# EAGLE design pa_only_900 (EAGLE 6.2)

## Sheet 1 of 4
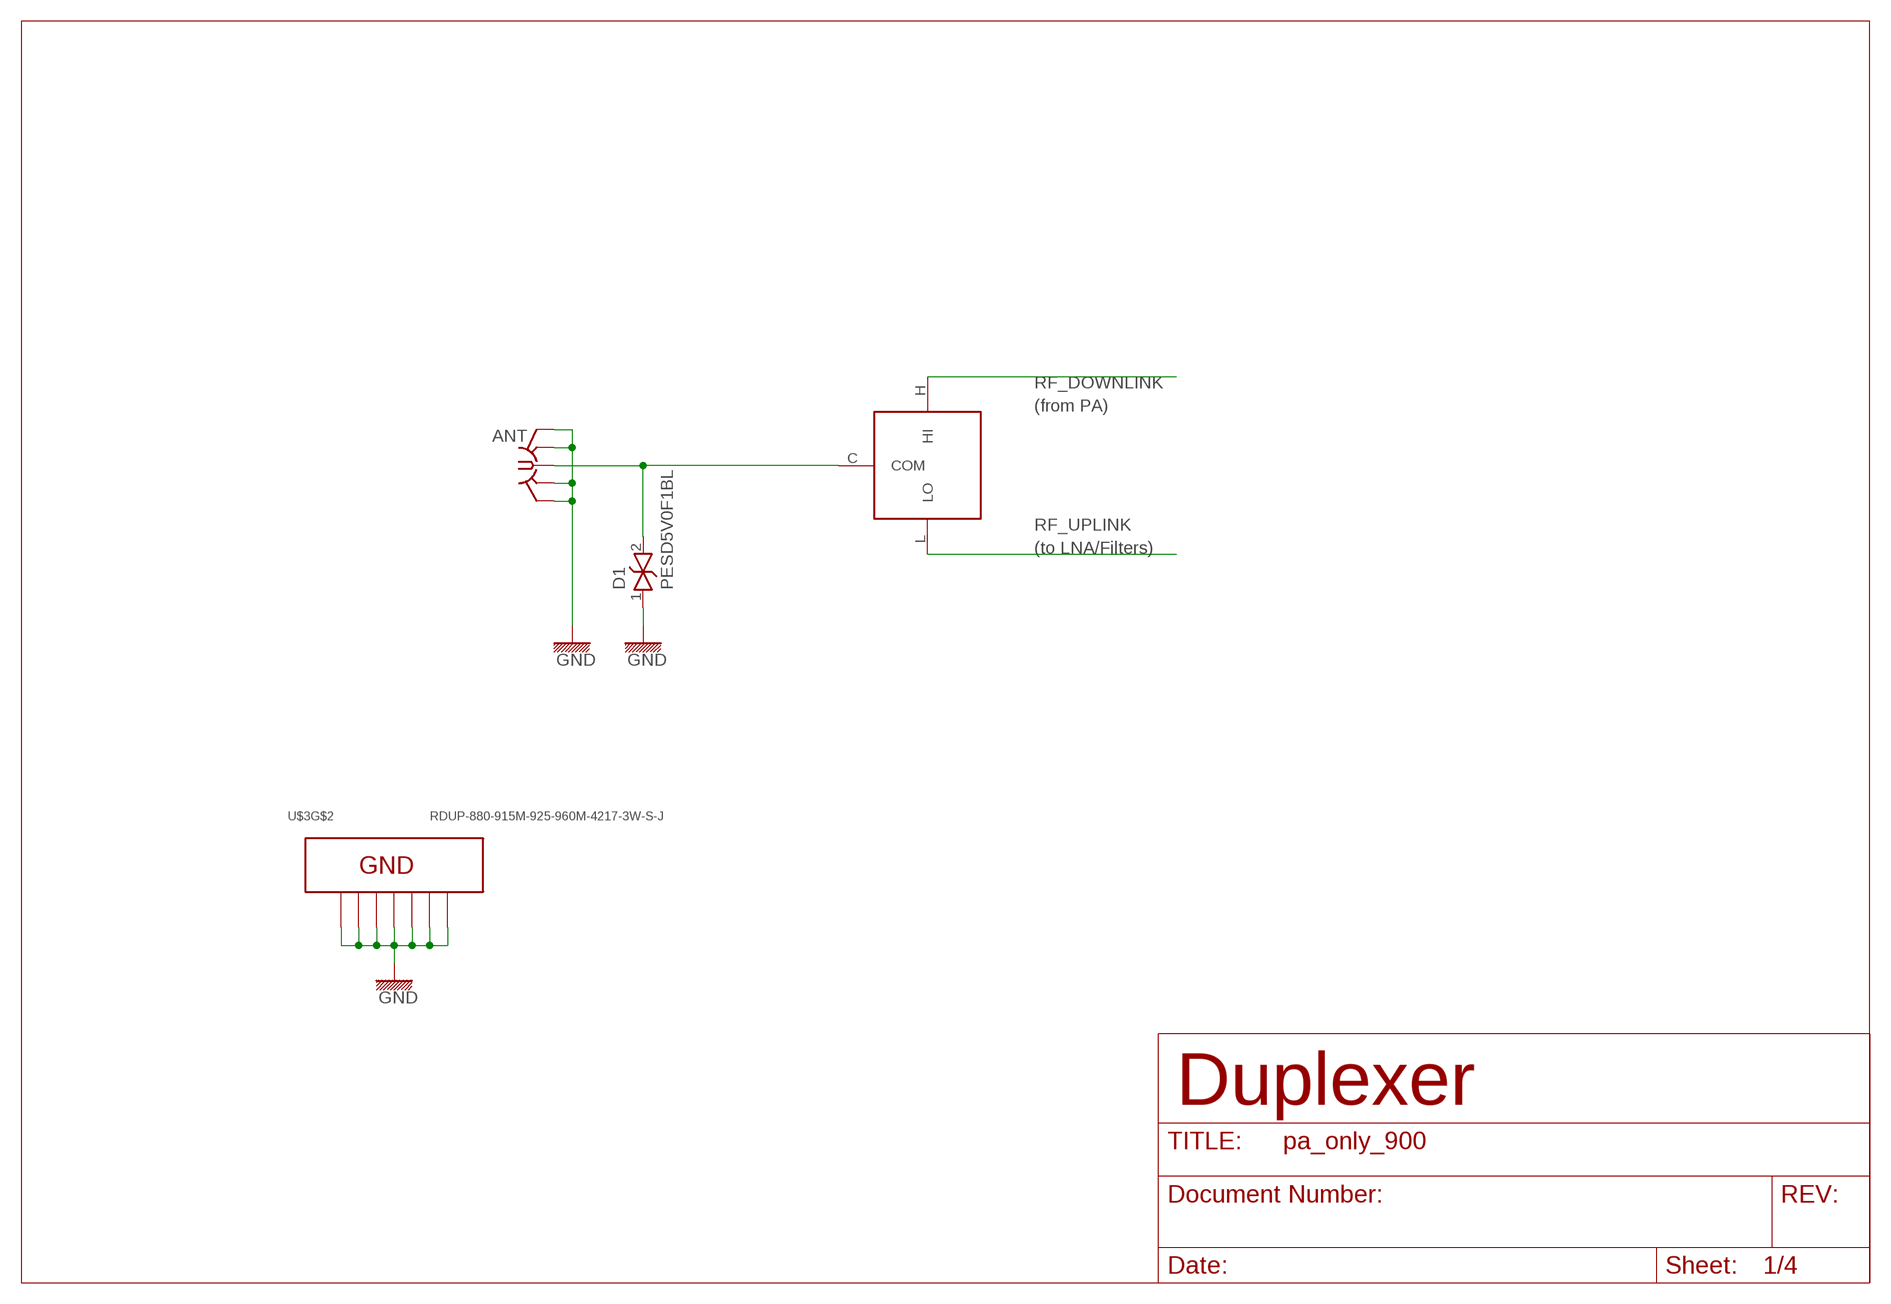
[diagram p0: schematic, sheet 1]

### Parts
ANT  SMA-F-S-TH  [SMA-F-S-TH]
D1  PESD5V0F1BL  D_ESD_SOD882  [SOD882]
U$3  RDUP-880-915M-925-960M-4217-3W-S-J  [RADITEK_4217]

### Nets
GND: ANT.G1(GND) ANT.G2(GND) ANT.G3(GND) ANT.G4(GND) D1.1 U$3.G1 U$3.G2 U$3.G3 U$3.G4 U$3.G5 U$3.G6 U$3.G7 ; also sheet 2,3,4
RF_ANT: ANT.C D1.2 U$3.C(COM)
RF_DOWNLINK: U$3.H(HI) ; also sheet 3
RF_UPLINK: U$3.L(LO) ; also sheet 2

### Notes on the sheet
- (from PA)
- (to LNA/Filters)
- Duplexer

## Sheet 2 of 4
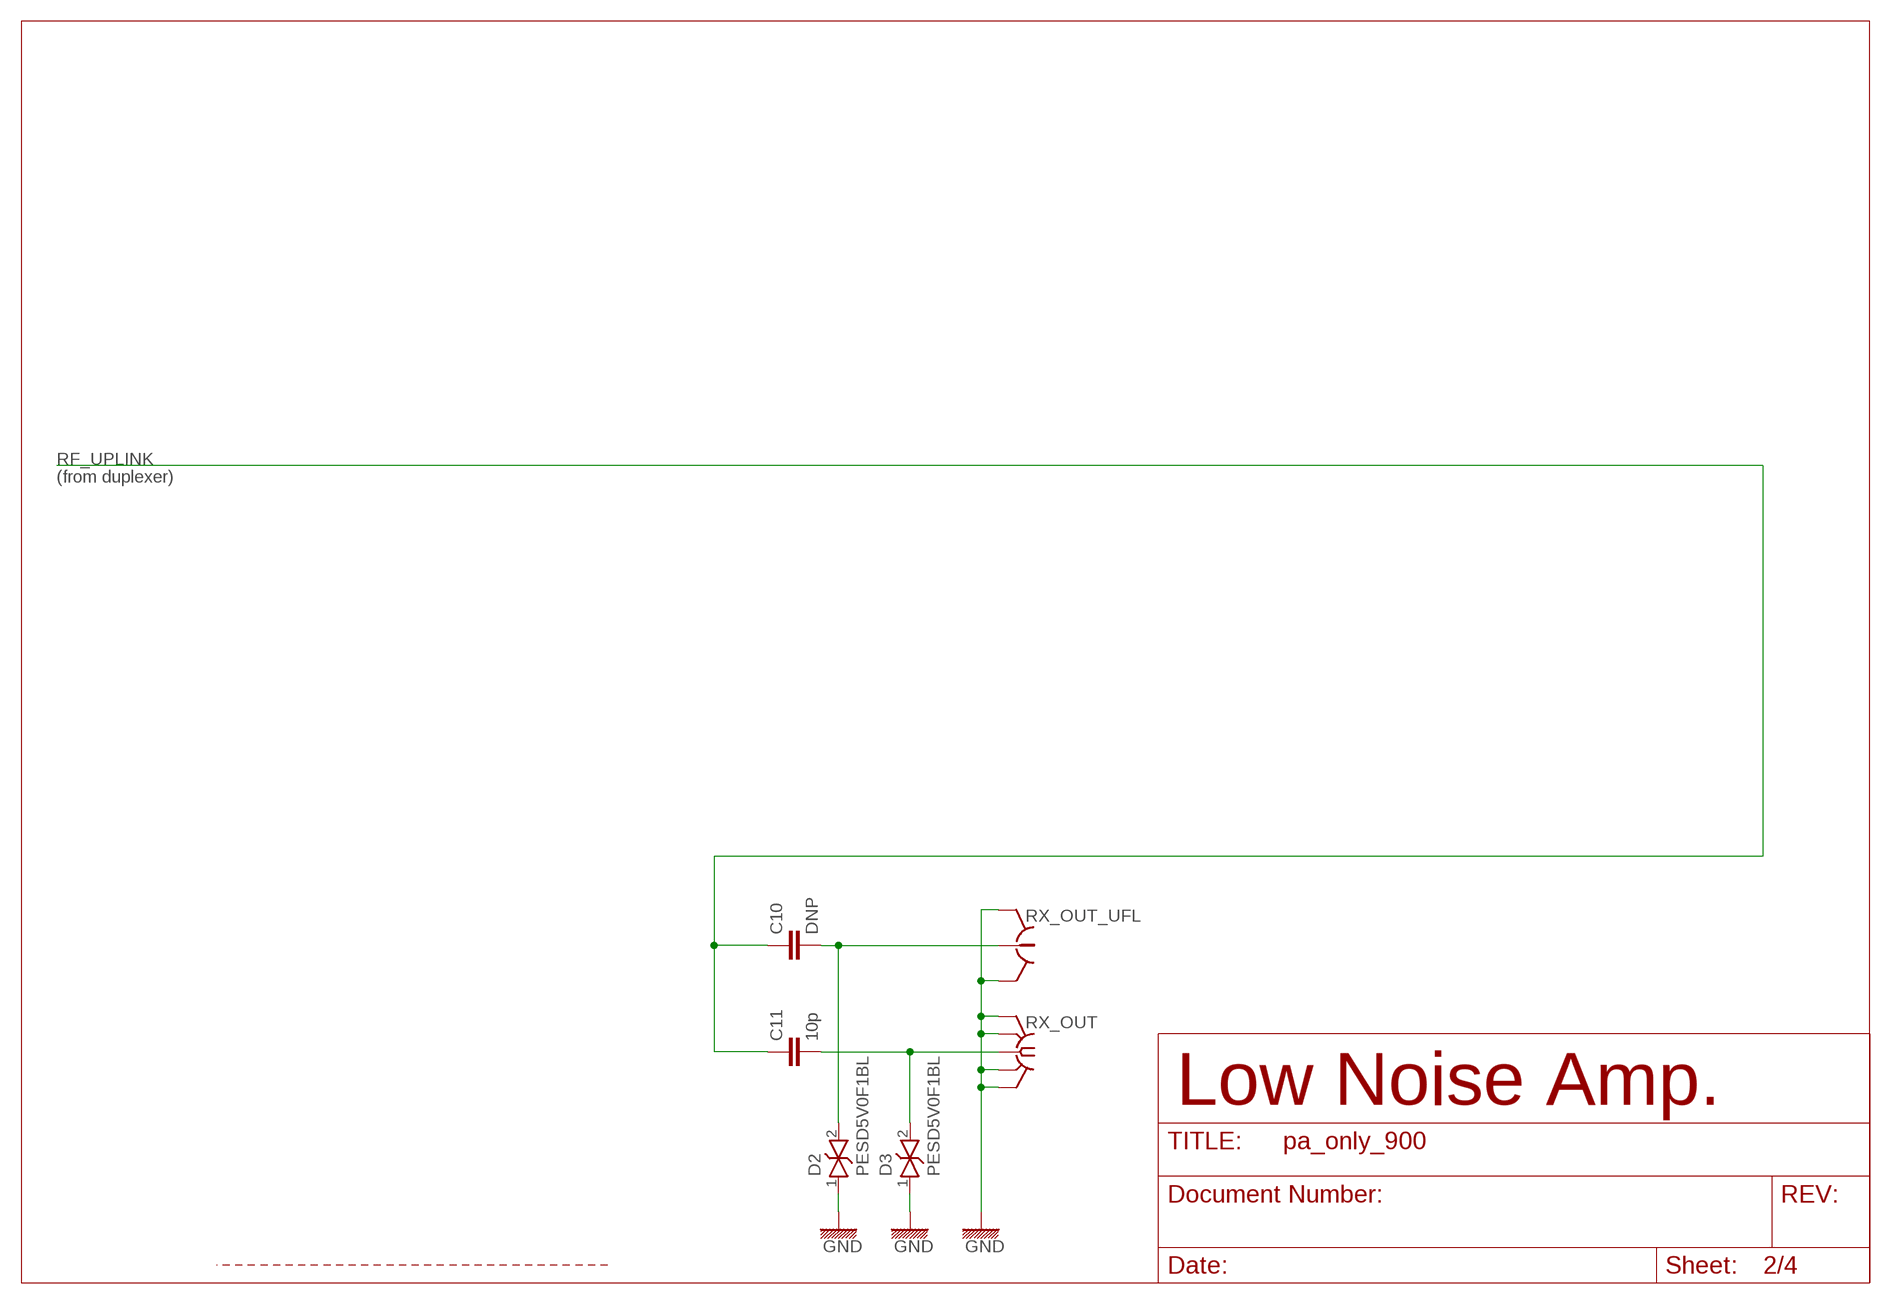
[diagram p1: schematic, sheet 2]

### Parts
C10  DNP  C-EU_0603  [0603]
C11  10p  C-EU_0603  [0603]
D2  PESD5V0F1BL  D_ESD_SOD882  [SOD882]
D3  PESD5V0F1BL  D_ESD_SOD882  [SOD882]
RX_OUT  SMA-F-S-TH  [SMA-F-S-TH]
RX_OUT_UFL  HRS_UFL  [HRS_UFL]

### Nets
GND: D2.1 D3.1 RX_OUT.G1(GND) RX_OUT.G2(GND) RX_OUT.G3(GND) RX_OUT.G4(GND) RX_OUT_UFL.GND@1(GND) RX_OUT_UFL.GND@2(GND) ; also sheet 1,3,4
N$8: C10.2 D2.2 RX_OUT_UFL.SIG
RF_UPLINK: C10.1 C11.1 ; also sheet 1
RF_UPLINK_OUT: C11.2 D3.2 RX_OUT.C

### Notes on the sheet
- (from duplexer)
- Low Noise Amp.

## Sheet 3 of 4
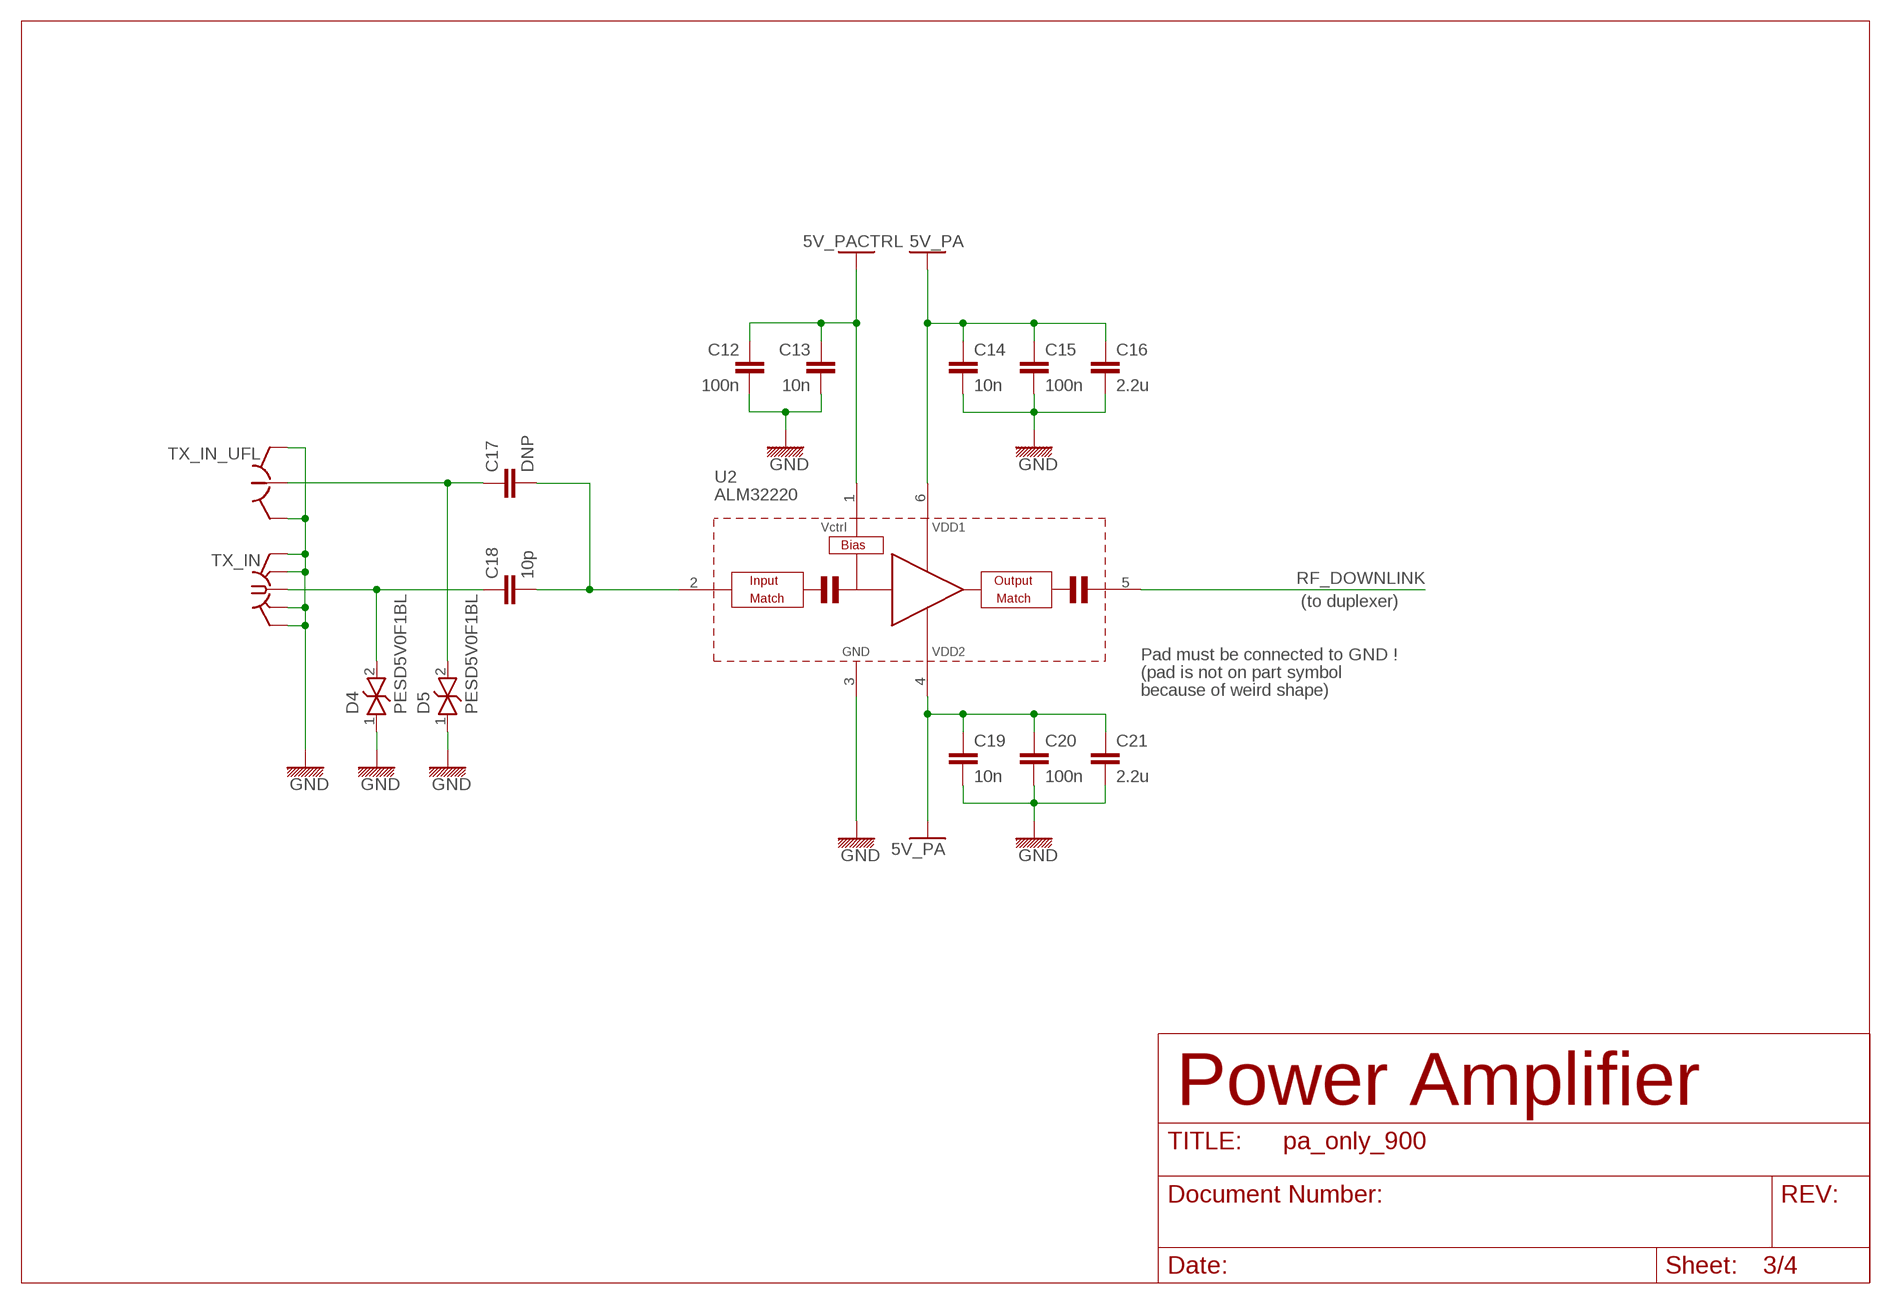
[diagram p2: schematic, sheet 3]

### Parts
C12  100n  C-EU_0603  [0603]
C13  10n  C-EU_0603  [0603]
C14  10n  C-EU_0603  [0603]
C15  100n  C-EU_0603  [0603]
C16  2.2u  C-EU_0805  [0805]
C17  DNP  C-EU_0603  [0603]
C18  10p  C-EU_0603  [0603]
C19  10n  C-EU_0603  [0603]
C20  100n  C-EU_0603  [0603]
C21  2.2u  C-EU_0805  [0805]
D4  PESD5V0F1BL  D_ESD_SOD882  [SOD882]
D5  PESD5V0F1BL  D_ESD_SOD882  [SOD882]
TX_IN  SMA-F-S-TH  [SMA-F-S-TH]
TX_IN_UFL  HRS_UFL  [HRS_UFL]
U2  ALM32220  [ALM32X20]

### Nets
5V_PA: C14.1 C15.1 C16.1 C19.1 C20.1 C21.1 U2.4(VDD2) U2.6(VDD1) ; also sheet 4
5V_PACTRL: C12.1 C13.1 U2.1(VCTRL) ; also sheet 4
GND: C12.2 C13.2 C14.2 C15.2 C16.2 C19.2 C20.2 C21.2 D4.1 D5.1 TX_IN.G1(GND) TX_IN.G2(GND) TX_IN.G3(GND) TX_IN.G4(GND) TX_IN_UFL.GND@1(GND) TX_IN_UFL.GND@2(GND) U2.3(GND) ; also sheet 1,2,4
N$2: C18.1 D4.2 TX_IN.C
N$3: C17.2 C18.2 U2.2(RF_IN)
N$14: C17.1 D5.2 TX_IN_UFL.SIG
RF_DOWNLINK: U2.5(RF_OUT) ; also sheet 1

### Notes on the sheet
- (to duplexer)
- Pad must be connected to GND !
- (pad is not on part symbol
- because of weird shape)
- Power Amplifier

## Sheet 4 of 4
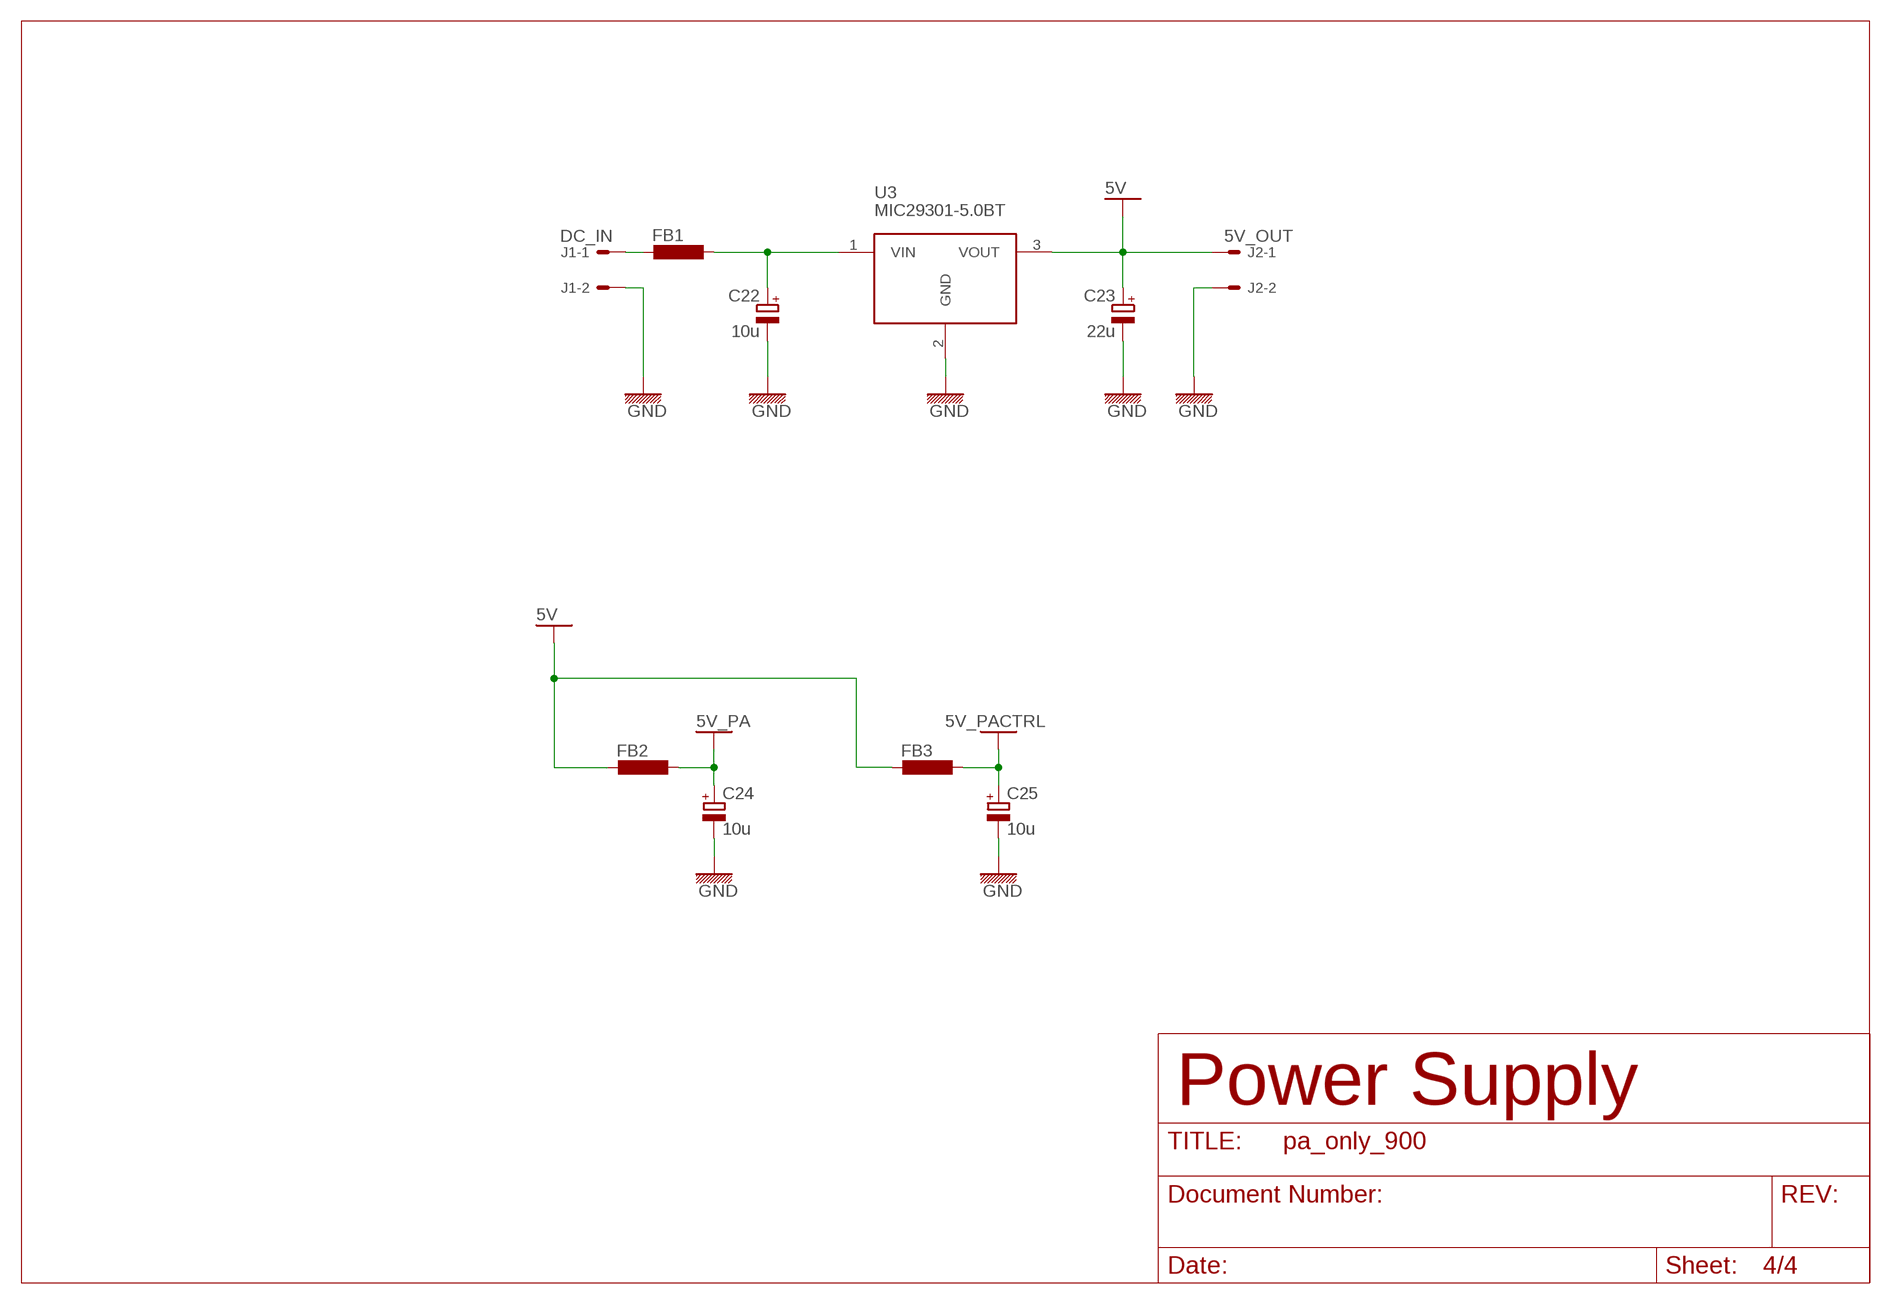
[diagram p3: schematic, sheet 4]

### Parts
C22  10u  CPOL-EUSMCA  [SMC_A]
C23  22u  CPOL-EUSMCA  [SMC_A]
C24  10u  CPOL-EUSMCA  [SMC_A]
C25  10u  CPOL-EUSMCA  [SMC_A]
FB1  FBEAD_1206  [1206]
FB2  FBEAD_1206  [1206]
FB3  FBEAD_0603  [0603]
J1  DC_IN  22-27-2021-02  [6410-02]
J2  5V_OUT  22-27-2021-02  [6410-02]
U3  MIC29301-5.0BT  MIC29XXX-FIX_WT_TO220BV  [TO220BV]

### Nets
5V: C23.+ FB2.1 FB3.1 J2.1 U3.3(VOUT)
5V_PA: C24.+ FB2.2 ; also sheet 3
5V_PACTRL: C25.+ FB3.2 ; also sheet 3
DC_IN: FB1.1 J1.1
DC_IN_FLT: C22.+ FB1.2 U3.1(VIN)
GND: C22.- C23.- C24.- C25.- J1.2 J2.2 U3.2(GND) ; also sheet 1,2,3

### Notes on the sheet
- Power Supply

## Library data of the parts
ANT RX_OUT TX_IN = we_conn:SMA-F
C10-C21 = we_passive:C-EU: Capacitor
C22-C25 = rcl:CPOL-EU: POLARIZED CAPACITOR, European symbol
D1-D5 = we_passive:D_ESD: Diode for ESD Protection Transient suppressors
FB1-FB3 = we_passive:FBEAD: INDUCTOR SMD Bead inductor
J1 J2 = con-molex:22-?-02: CONNECTOR wire to board 2.54 mm (.1 inch) pitch header; OC_FARNELL: unknown; OC_NEWARK: unknown
RX_OUT_UFL TX_IN_UFL = we_conn:HRS_UFL: Hirose U.FL SMT
U2 = we_chips:ALM32220
U3 = we_chips:MIC29XXX-FIX: Micrel MIC29xxx series (fixed output versions)
U$3 = laforge:RDUP-880-915M-925-960M-4217-3W-S-J: Raditek Ceramic Duplexer 880-915MHz / 925-960MHz, Model 4216, 3 Watts, Surface Mount

## Board
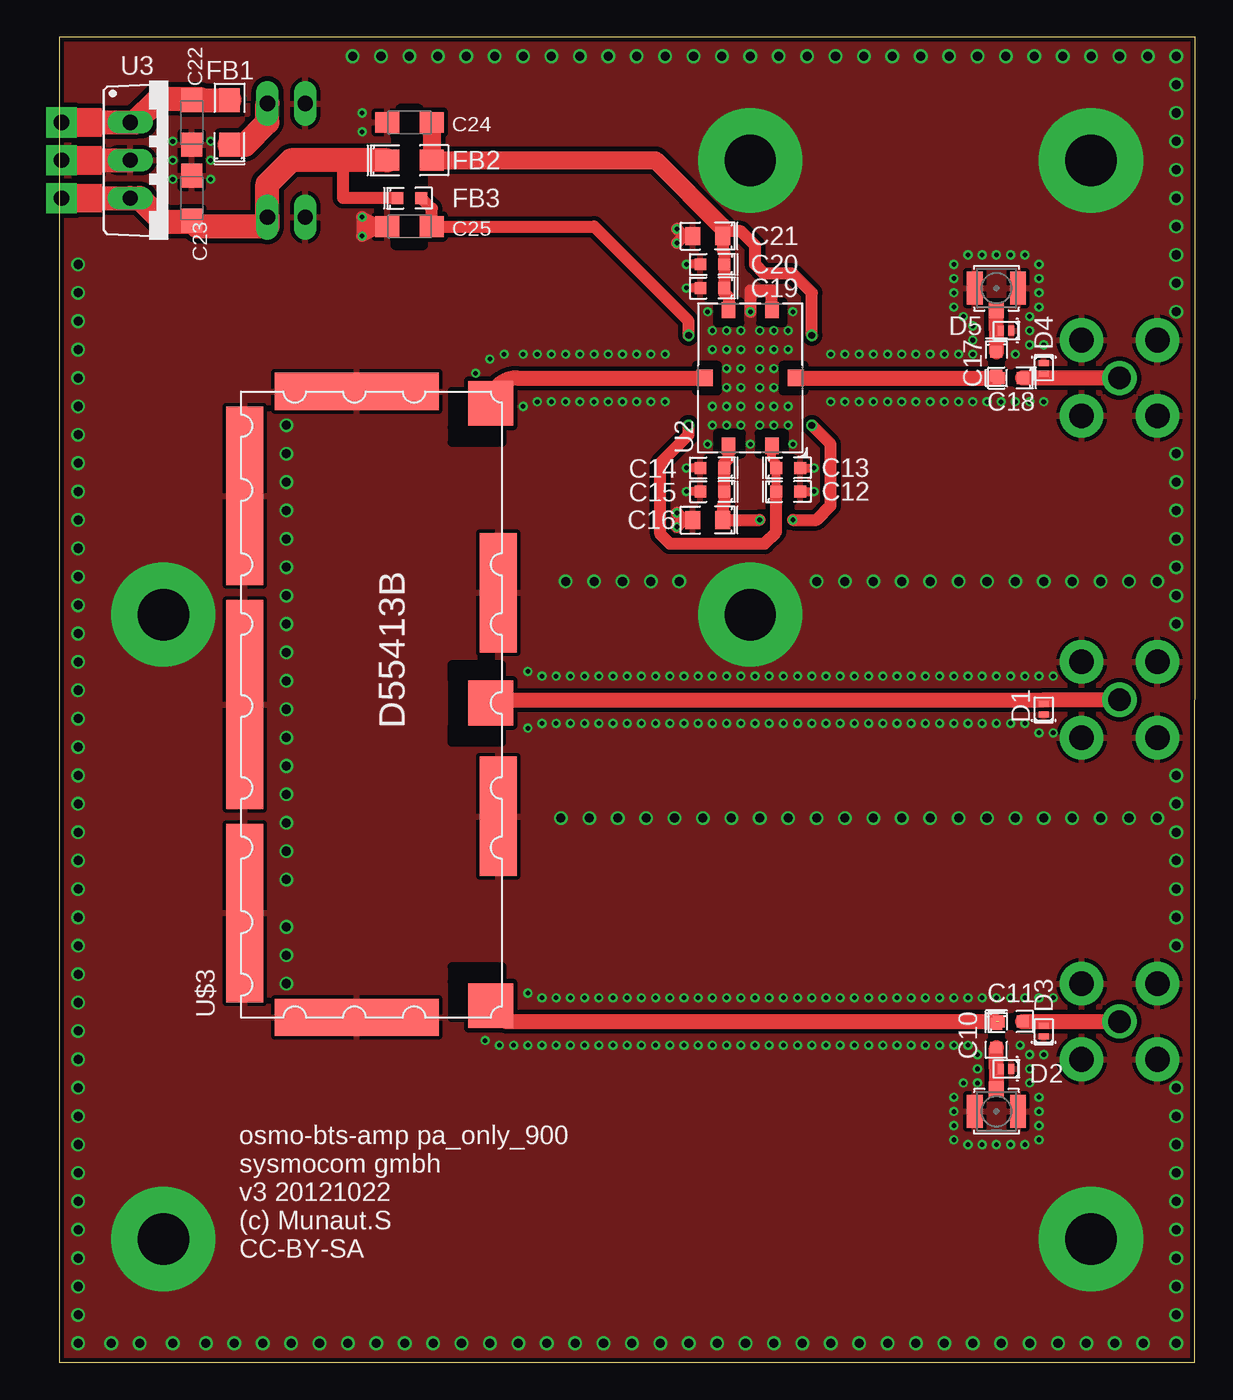
[diagram p4: board, top side]
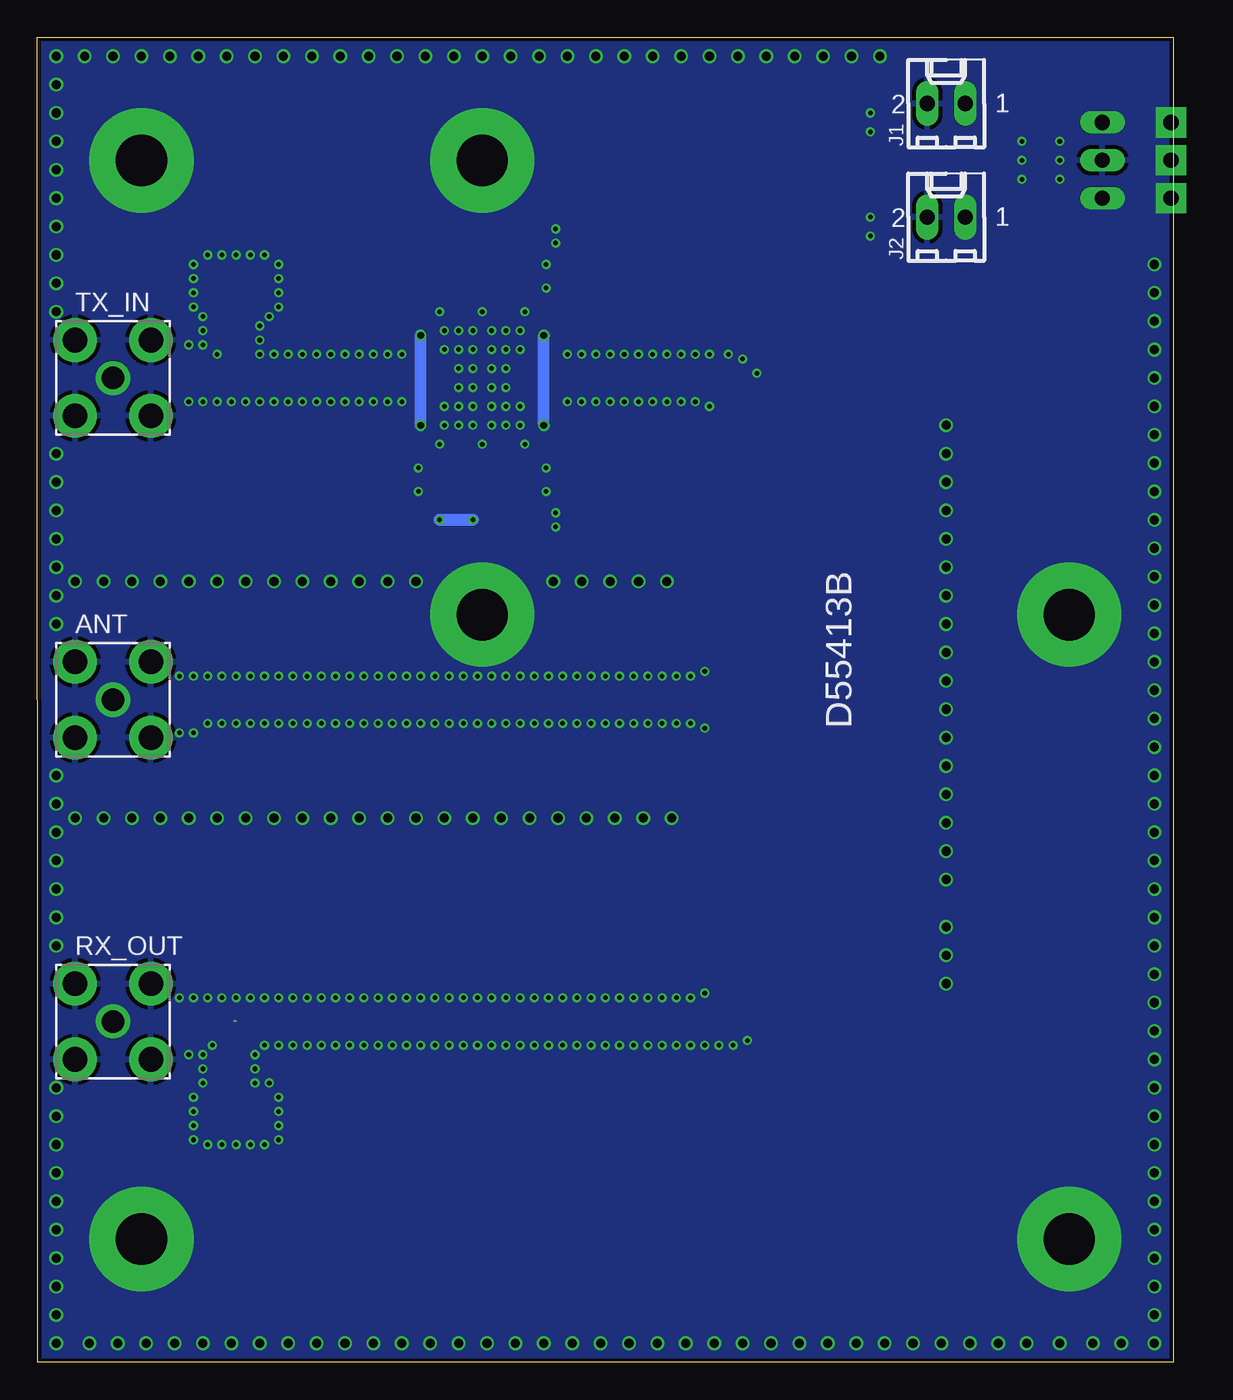
[diagram p5: board, bottom side, seen from below]

Size 76.2 x 88.9 mm. Coordinates in mm from the lower left corner, seen from the top.
Outline: 0,0 76.18,0 76.2,88.9 0,88.9 0,0
Copper layers (1*16): Top 0.035mm / dielectric 1.5mm / Bottom 0.035mm
Design rules: minimum track width 6mil, minimum drill 12mil, track to track 0.006275mm, track to pad 6mil, pad to pad 6mil, via to via 6mil, smd to smd 0mil, copper to edge 10mil, drill to drill 10mil, minimum pad ring 10mil, minimum via ring 6mil, stop-mask expansion 2mil, vias tented up to drill 100mil, thermal gap 10mil
tRestrict: area 22.5,74.9 to 24.4,82.2; area 22.5,79.7 to 24.4,81.6; area 22.9,82.2 to 24.1,84.1; area 48.6,57.8 to 49.2,60.6; area 43.2,55.6 to 43.8,57.5; area 43.5,57.8 to 44.1,60.6; area 43.5,71.4 to 44.1,74.3; area 43.2,74.6 to 43.8,76.5

### Footprints (pad centres in the part's own frame; a part is rotated, then mirrored left to right if it is on the bottom)
SMA-F-S-TH = drill 1.524: C 0,0 | drill 1.651 pad 2.921: G1 -2.54,2.54; G2 2.54,2.54; G3 -2.54,-2.54; G4 2.54,-2.54
0603 = smd 0.8 x 0.8: 1 -0.8,0; 2 0.8,0
0805 = smd 1 x 1.2: 1 -1,0; 2 1,0
SMC_A = smd 1.6 x 1.4: + -1.5,0; - 1.5,0
SOD882 = smd 0.4 x 0.7: 1 -0.35,0; 2 0.35,0
1206 = smd 1.6 x 1.4: 1 -1.5,0; 2 1.5,0
6410-02 = drill 1.016 long: 1 1.27,0; 2 -1.27,0
HRS_UFL = smd 1.05 x 2.2: GND@1 -1.452,0; GND@2 1.452,0 | smd 1 x 1.05: SIG 0,-1.502
ALM32X20 = smd 0.9 x 1.1: 1 -1.45,4.55; 3 -1.45,-4.55; 4 1.45,-4.55; 6 1.45,4.55 | smd 1.1 x 1.1: 2 -3.05,0; 5 3.05,0
TO220BV = drill 1.016 long: 1 -2.54,-2.54; 2 0,-2.54; 3 2.54,-2.54
RADITEK_4217 = smd 3 x 3: C 0.1,-8; H 20.2,-8; L -20.2,-8 | smd 12 x 2.5: G1 -14,8.5; G3 14,8.5 | smd 14 x 2.5: G2 0,8.5 | smd 8 x 2.5: G4 -7.5,-8.5; G5 7.5,-8.5 | smd 2.5 x 11: G6 -21,1; G7 21,1

### Placement (x,y rotation side)
ANT  71.12,44.45 180 bottom
C10  62.87,21.91 270 top
C11  63.82,22.86 0 top
C12  48.9,58.42 0 top
C13  48.9,60.01 0 top
C14  43.81,60.01 180 top
C15  43.81,58.42 180 top
C16  43.5,56.52 180 top
C17  62.87,66.99 270 top
C18  63.82,66.04 180 top
C19  43.81,72.07 180 top
C20  43.81,73.66 180 top
C21  43.5,75.56 180 top
C22  8.89,83.19 270 top
C23  8.89,78.11 90 top
C24  23.5,83.19 180 top
C25  23.5,76.2 180 top
D1  66.04,43.81 90 top
D2  63.5,19.68 180 top
D3  66.04,22.23 90 top
D4  66.04,66.67 270 top
D5  63.5,69.22 180 top
FB1  11.43,83.19 90 top
FB2  23.5,80.64 0 top
FB3  23.5,78.11 0 top
J1  15.24,84.45 0 bottom
J2  15.24,76.83 0 bottom
RX_OUT  71.12,22.86 180 bottom
RX_OUT_UFL  62.87,16.83 180 top
TX_IN  71.12,66.04 180 bottom
TX_IN_UFL  62.87,72.07 0 top
U2  46.35,66.04 180 top
U3  7.3,80.64 270 top
U$3  20.95,44.13 90 top

### Tracks (layer width: path | path; a pad name or v marks a point on that pad's centre or on a via)
5V  (via drill 1.02 pad 2.03)
  Top 0.813: FB3.1 19.05,78.11 19.05,80.64
  Top 1.626: FB2.1 19.05,80.64 15.56,80.64 13.97,79.06 J2.1 13.97,76.2 9.29,76.2 C23.+ 8.8,76.52 6.99,76.52 5.4,78.11 U3.3 v0.16,78.11
5V_PA  (via drill 0.3, 0.46)
  Top 0.813: U2.6 44.91,60.62 44.61,60.33 C14.1 C15.1 44.62,57.62 44.5,57.42 C16.1 v46.99,56.52 | U2.4 44.91,71.46 44.61,71.75 C19.1 C20.1 44.62,74.46 44.5,74.66 C21.1 44.77,75.83 44.77,75.88 | v49.21,56.52 50.8,56.52 51.75,57.47 51.75,61.59 v50.48,62.87 | v50.48,68.9 50.48,71.75 49.21,73.03 47.31,73.03 46.67,73.66 46.67,74.93 45.72,75.88 44.77,75.88 | 44.77,75.88 44.45,76.2
  Top 1.219: C24.+ FB2.2 40.01,80.64 44.45,76.2
  Bottom 0.813: v46.99,56.52 v49.21,56.52 | v50.48,62.87 v50.48,68.9
5V_PACTRL  (via drill 0.46)
  Top 0.61: U2.1 47.8,60.62 48.09,60.33 C13.1 C12.1
  Top 0.813: C12.1 48.09,55.72 47.31,54.93 40.96,54.93 40.32,55.56 40.32,60.33 42.23,62.23 v42.23,62.87 | v42.23,68.9 42.23,69.85 35.88,76.2 C25.+ 25,77.41 FB3.2
  Bottom 0.813: v42.23,62.87 v42.23,68.9
DC_IN
  Top 1.626: FB1.1 12.47,81.69 13.97,83.19 J1.1
DC_IN_FLT  (via drill 1.02 pad 2.03)
  Top 1.626: C22.+ 9.53,84.69 | 9.53,84.69 FB1.2 | v0.16,83.19 U3.1 5.08,83.19 6.67,84.77 9.44,84.77 9.53,84.69
GND  (via drill 0.3, 0.61, 1.02 pad 2.03, 3.45 pad 7)
  Top 0.61: C20.2 v42.07,73.66 | C19.2 v42.07,72.07 | C14.2 v42.07,60.01 | C15.2 v42.07,58.42 | C13.2 v50.64,60.01 | C12.2 v50.64,58.42
  Top 0.813: 41.91,75.56 | v41.43,75.09 41.91,75.56 | 41.91,75.56 C21.2 | 41.91,75.56 v41.43,76.04 | v41.43,56.04 41.91,56.52 | C16.2 41.91,56.52 | 41.91,56.52 v41.43,56.99 | 21.59,76.2 v20.32,76.83 v20.32,75.56 21.59,76.2 | C25.- 21.59,76.2 | U2.3 47.8,71.91 46.35,71.91 v46.35,70.48
  Top 1.626: v0.16,80.64 U3.2
  other vias: 58.1,46.04 45.72,66.67 44.77,66.67 46.99,66.67 47.94,66.67 47.94,65.41 46.99,65.41 45.72,65.41 44.77,65.41 44.77,64.14 45.72,64.14 46.99,64.14 47.94,64.14 45.72,67.94 44.77,67.94 46.99,67.94 47.94,67.94 47.94,69.22 46.99,69.22 45.72,69.22 44.77,69.22 44.77,62.87 45.72,62.87 46.99,62.87 47.94,62.87 48.9,64.14 48.9,62.87 43.81,64.14 43.81,62.87 43.81,67.94 43.81,69.22 48.9,69.22 48.9,67.94 43.5,70.48 49.21,70.48 46.35,61.59 43.5,61.59 49.21,61.59 60.01,21.27 33.34,46.04 34.29,46.04 35.24,46.04 36.2,46.04 37.15,46.04 38.1,46.04 39.05,46.04 40.01,46.04 40.96,46.04 41.91,46.04 42.86,46.04 43.81,46.04 44.77,46.04 33.34,42.86 34.29,42.86 35.24,42.86 36.2,42.86 37.15,42.86 38.1,42.86 39.05,42.86 40.01,42.86 40.96,42.86 41.91,42.86 42.86,42.86 43.81,42.86 44.77,42.86 45.72,42.86 46.67,42.86 47.62,42.86 48.58,42.86 49.53,42.86 50.48,42.86 51.44,42.86 52.39,42.86 53.34,42.86 54.29,42.86 55.24,42.86 56.2,42.86 57.15,42.86 58.1,42.86 59.05,42.86 60.01,42.86 45.72,46.04 46.67,46.04 47.62,46.04 48.58,46.04 49.53,46.04 50.48,46.04 51.44,46.04 52.39,46.04 53.34,46.04 54.29,46.04 55.24,46.04 56.2,46.04 57.15,46.04 59.05,46.04 33.02,67.63 33.97,67.63 34.92,67.63 35.88,67.63 36.83,67.63 37.78,67.63 38.73,67.63 39.69,67.63 40.64,67.63 33.02,64.45 33.97,64.45 34.92,64.45 35.88,64.45 36.83,64.45 37.78,64.45 38.73,64.45 39.69,64.45 40.64,64.45 51.75,67.63 52.7,67.63 53.66,67.63 54.61,67.63 55.56,67.63 56.52,67.63 57.47,67.63 58.42,67.63 59.37,67.63 60.33,67.63 60.33,64.45 59.37,64.45 58.42,64.45 57.47,64.45 56.52,64.45 55.56,64.45 54.61,64.45 53.66,64.45 52.7,64.45 51.75,64.45 74.93,74.3 74.93,76.2 74.93,78.11 74.93,80.01 51.75,1.27 74.93,1.27 74.93,3.17 74.93,5.08 74.93,6.99 49.85,1.27 47.94,1.27 46.04,1.27 44.13,1.27 42.23,1.27 40.32,1.27 38.42,1.27 36.51,1.27 34.61,1.27 32.7,1.27 30.8,1.27 28.89,1.27 26.99,1.27 25.08,1.27 23.18,1.27 21.27,1.27 19.37,1.27 17.46,1.27 15.56,1.27 13.65,1.27 11.75,1.27 9.84,1.27 1.27,1.27 3.49,1.27 5.4,1.27 7.62,1.27 1.27,3.17 1.27,5.08 1.27,6.99 1.27,8.89 1.27,10.79 1.27,12.7 1.27,14.61 1.27,16.51 1.27,18.41 1.27,20.32 71.75,52.39 69.85,52.39 67.94,52.39 66.04,52.39 64.14,52.39 64.14,36.51 66.04,36.51 67.94,36.51 69.85,36.51 71.75,36.51 62.23,36.51 60.33,36.51 58.42,36.51 56.52,36.51 54.61,36.51 52.7,36.51 50.8,36.51 48.9,36.51 46.99,36.51 45.09,36.51 33.66,36.51 43.18,36.51 41.27,36.51 39.37,36.51 37.47,36.51 35.56,36.51 62.23,52.39 60.33,52.39 58.42,52.39 56.52,52.39 54.61,52.39 33.97,52.39 39.69,52.39 37.78,52.39 35.88,52.39 74.93,72.39 73.03,87.63 71.12,87.63 69.22,87.63 67.31,87.63 65.41,87.63 15.24,29.21 15.24,34.29 15.24,32.38 15.24,36.2 15.24,38.1 15.24,40.01 15.24,41.91 15.24,43.81 15.24,45.72 15.24,47.62 15.24,49.53 15.24,51.44 15.24,62.87 15.24,53.34 15.24,55.24 1.27,22.23 1.27,24.13 1.27,26.04 1.27,27.94 1.27,29.84 1.27,31.75 1.27,33.66 1.27,35.56 1.27,37.47 1.27,39.37 1.27,41.27 1.27,43.18 1.27,45.09 1.27,46.99 1.27,48.9 1.27,50.8 1.27,52.7 1.27,54.61 1.27,56.52 1.27,58.42 1.27,60.33 1.27,62.23 15.24,57.15 46.35,50.16 46.35,80.64 7.62,81.92 7.62,80.64 7.62,79.38 10.16,81.92 10.16,80.64 10.16,79.38 6.99,50.16 69.22,8.26 6.99,8.26 69.22,80.64 20.32,83.82 20.32,82.55 32.38,46.04 31.43,46.35 32.38,42.86 31.43,42.55 32.07,64.45 31.11,64.14 32.07,67.63 31.11,67.63 61.28,67.63 61.28,64.45 62.23,64.45 63.18,64.45 64.14,64.45 64.14,67.63 65.09,64.45 66.04,64.45 65.09,68.26 66.04,68.26 61.28,68.58 61.28,69.53 60.64,70.17 60.01,70.8 60.01,71.75 60.01,72.71 60.01,73.66 60.96,74.3 61.91,74.3 62.87,74.3 63.82,74.3 64.77,74.3 65.72,73.66 65.72,72.71 65.72,71.75 65.72,70.8 65.09,70.17 65.09,69.22 60.01,46.04 60.96,46.04 61.91,46.04 62.87,46.04 63.82,46.04 64.77,46.04 65.72,46.04 66.67,46.04 60.96,42.86 61.91,42.86 62.87,42.86 63.82,42.86 64.77,42.86 65.72,42.23 66.67,42.23 60.01,24.45 60.96,24.45 61.91,24.45 62.87,24.45 63.82,24.45 64.77,24.45 65.72,24.45 66.67,24.45 62.87,14.61 63.82,14.61 64.77,14.61 61.91,14.61 60.96,14.61 60.01,14.92 60.01,15.88 60.01,16.83 60.01,17.78 60.64,18.73 61.59,18.73 60.96,21.27 61.59,20.64 61.59,19.68 65.72,14.92 65.72,15.88 65.72,16.83 65.72,17.78 65.09,18.73 65.09,19.68 65.09,20.64 64.45,21.27 66.04,20.64 1.27,64.14 1.27,66.04 1.27,67.94 1.27,69.85 1.27,71.75 1.27,73.66 53.66,1.27 55.56,1.27 57.47,1.27 59.37,1.27 61.28,1.27 63.18,1.27 65.09,1.27 66.99,1.27 68.9,1.27 70.8,1.27 72.71,1.27 74.93,8.89 74.93,10.79 74.93,12.7 74.93,14.61 74.93,16.51 74.93,18.41 74.93,81.92 74.93,83.82 74.93,85.72 74.93,87.63 63.5,87.63 61.59,87.63 59.69,87.63 57.78,87.63 55.88,87.63 53.98,87.63 52.07,87.63 50.16,87.63 48.26,87.63 46.35,87.63 44.45,87.63 42.55,87.63 40.64,87.63 38.73,87.63 36.83,87.63 34.92,87.63 33.02,87.63 31.11,87.63 29.21,87.63 27.3,87.63 25.4,87.63 23.5,87.63 21.59,87.63 19.68,87.63 74.93,60.96 74.93,59.05 74.93,57.15 74.93,55.24 74.93,53.34 74.93,51.44 74.93,49.53 74.93,39.37 74.93,37.47 74.93,35.56 74.93,33.66 74.93,31.75 74.93,29.84 74.93,27.94 74.93,70.48 73.66,36.51 41.59,52.39 52.7,52.39 50.8,52.39 73.66,52.39 15.24,59.05 15.24,60.96 15.24,27.3 15.24,25.4 31.43,24.77 32.38,24.45 33.34,24.45 34.29,24.45 35.24,24.45 36.2,24.45 37.15,24.45 38.1,24.45 39.05,24.45 40.01,24.45 40.96,24.45 41.91,24.45 42.86,24.45 43.81,24.45 44.77,24.45 45.72,24.45 46.67,24.45 47.62,24.45 48.58,24.45 49.53,24.45 50.48,24.45 51.44,24.45 52.39,24.45 53.34,24.45 54.29,24.45 55.24,24.45 56.2,24.45 57.15,24.45 58.1,24.45 59.05,24.45 32.38,21.27 33.34,21.27 34.29,21.27 35.24,21.27 36.2,21.27 37.15,21.27 38.1,21.27 39.05,21.27 40.01,21.27 40.96,21.27 41.91,21.27 42.86,21.27 43.81,21.27 44.77,21.27 45.72,21.27 46.67,21.27 47.62,21.27 48.58,21.27 49.53,21.27 50.48,21.27 51.44,21.27 52.39,21.27 53.34,21.27 54.29,21.27 55.24,21.27 56.2,21.27 57.15,21.27 58.1,21.27 59.05,21.27 29.84,67.63 28.89,67.31 27.94,66.36 31.43,21.27 30.48,21.27 29.53,21.27 28.57,21.59
  pour Top (isolate 0.305): 75.88,0.32 0.32,0.32 0.32,88.58 75.88,88.58
  pour Bottom: 0.32,88.58 75.88,88.58 75.88,0.32 0.32,0.32
N$2
  Top 0.305: D4.2 66.04,66.04
  Top 1.016: C18.1 66.04,66.04 TX_IN.C
N$3
  Top 0.813: C17.2 63.02,66.19 C18.2
  Top 1.016: U2.2 C18.2
N$8
  Top 0.305: D2.2 62.87,19.68
  Top 1.016: C10.2 62.87,19.68 RX_OUT_UFL.SIG
N$14
  Top 0.305: D5.2 62.87,69.22
  Top 1.016: TX_IN_UFL.SIG 62.87,69.22 C17.1
RF_ANT
  Top 0.305: D1.2 66.04,44.45
  Top 1.016: ANT.C 66.04,44.45 29.67,44.45 arc90 U$3.C
RF_DOWNLINK
  Top 1.016: U2.5 30.66,66.04 arc90 U$3.H
RF_UPLINK  (1 unrouted)
  Top 0.813: C10.1 63.02,22.71 C11.1
  Top 1.016: 62.87,22.86 30.34,22.86 arc-90 U$3.L
RF_UPLINK_OUT
  Top 0.305: D3.2 66.04,22.86
  Top 1.016: C11.2 66.04,22.86 RX_OUT.C
(copper drawn outside any net)
  shapes: Top area x3

### Text on the board
tPlace: D55413B | sysmocom gmbh | (c) Munaut.S | CC-BY-SA
bPlace: D55413B
tNames: osmo-bts-amp pa_only_900 | v3 20121022